# Altium project mecobo3.PrjPcb (part 2 of 2)
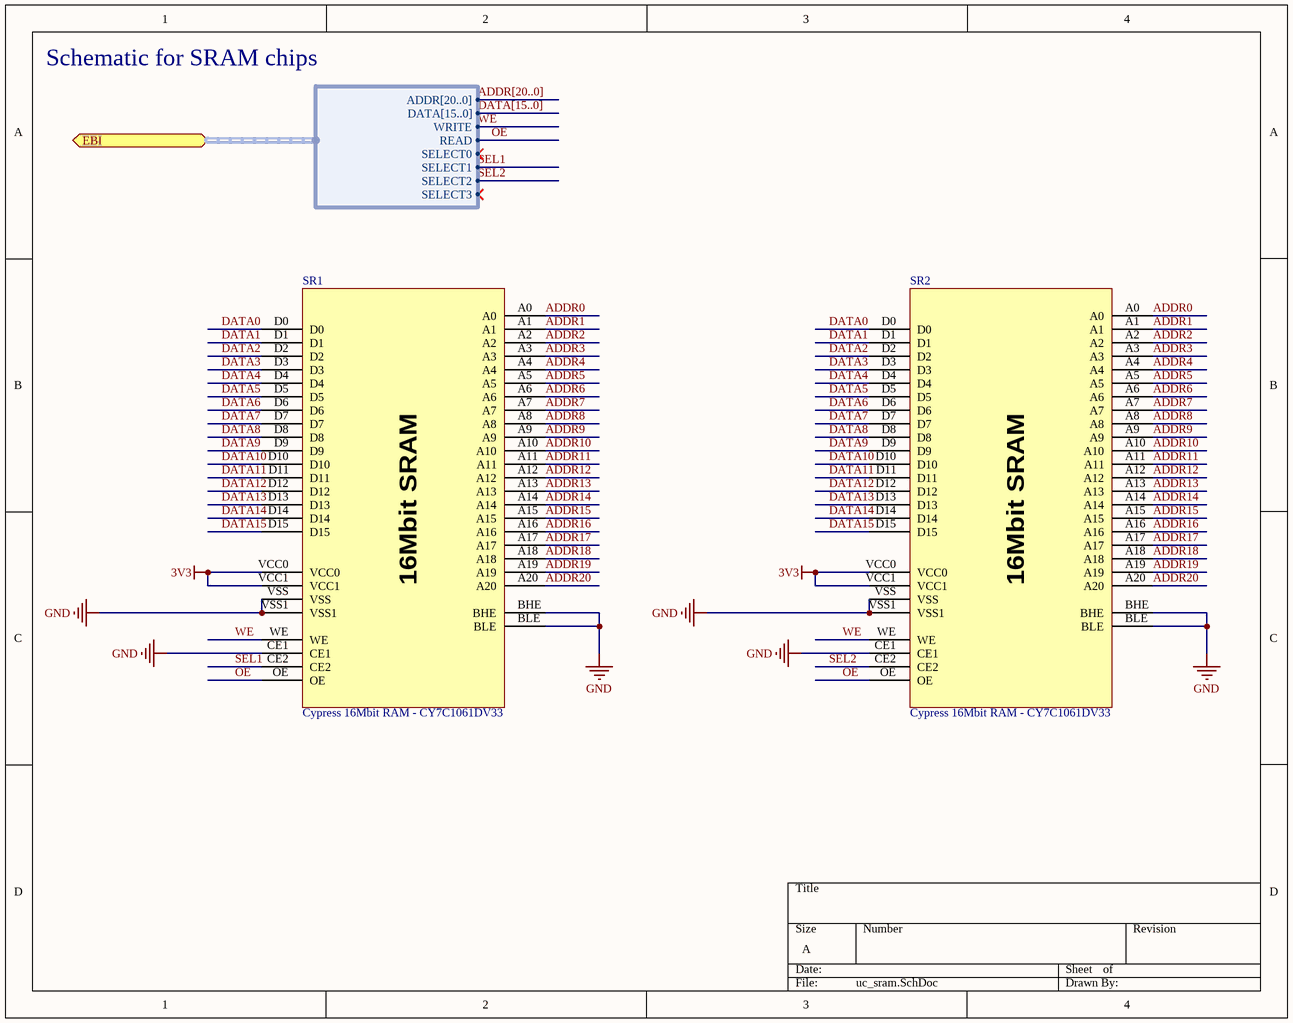
[diagram p14: uc_sram.SchDoc]

## Nets that join several sheets
0V9: xcs6slx25-2csg324i (FPGA.C1 FPGA.M5 FPGA.N3), psu (0V9.2), ddr2_memory (DDR.E2)
1V2: xcs6slx25-2csg324i (11 pins), psu (C2#1.1 POWT.1), MIC5248 (C4#3.2 MIC1.5), decoupling (10 pins)
1V8: xcs6slx25-2csg324i (30 pins), psu (C3#1.1 POWT.2), U_psu/MAX8860EUA18 (C1#2.2 PSU1.1 PSU1.4 R1#2.2), decoupling (10 pins), ddr2_memory (10 pins)
3V3: toplevel (OSC.1 OSC.4), efn32gg990 (11 pins), xcs6slx25-2csg324i (6 pins), psu (0V9.1 C1#1.1 POWT.3), U_psu/MAX8860EUA33 (C4#2.2 PSU2.1 PSU2.4 R2#2.2), MIC5248 (MIC1.3), decoupling (32 pins), headers (7 pins), uc_sram (SR1.VCC0 SR1.VCC1 SR2.VCC0 SR2.VCC1)
5V0: psu (C4#1.1 C6#1.1 D3.1 D5.1), U_psu/MAX8860EUA18 (C2#2.2 PSU1.2 PSU1.7), U_psu/MAX8860EUA33 (C5#1.2 PSU2.2 PSU2.7), MIC5248 (MIC1.1)
GND: toplevel (L1.1 OSC.2 R8.1), efn32gg990 (29 pins), xcs6slx25-2csg324i (44 pins), psu (9 pins), U_psu/MAX8860EUA18 (5 pins), U_psu/MAX8860EUA33 (5 pins), MIC5248 (C4#3.1 MIC1.2), decoupling (52 pins), ddr2_memory (11 pins), headers (7 pins), uc_sram (10 pins)
ADDR0: efn32gg990 (U.J4), xcs6slx25-2csg324i (FPGA.V5), uc_sram (SR1.A0 SR2.A0)
ADDR1: efn32gg990 (U.K3), xcs6slx25-2csg324i (FPGA.V4), uc_sram (SR1.A1 SR2.A1)
ADDR2: efn32gg990 (U.L3), xcs6slx25-2csg324i (FPGA.V3), uc_sram (SR1.A2 SR2.A2)
ADDR3: efn32gg990 (U.J7), xcs6slx25-2csg324i (FPGA.N6), uc_sram (SR1.A3 SR2.A3)
ADDR4: efn32gg990 (U.J8), xcs6slx25-2csg324i (FPGA.V6), uc_sram (SR1.A4 SR2.A4)
ADDR5: efn32gg990 (U.G10), xcs6slx25-2csg324i (FPGA.P6), uc_sram (SR1.A5 SR2.A5)
ADDR6: efn32gg990 (U.G11), xcs6slx25-2csg324i (FPGA.V7), uc_sram (SR1.A6 SR2.A6)
ADDR7: efn32gg990 (U.E9), xcs6slx25-2csg324i (FPGA.V11), uc_sram (SR1.A7 SR2.A7)
ADDR8: efn32gg990 (U.E10), xcs6slx25-2csg324i (FPGA.V10), uc_sram (SR1.A8 SR2.A8)
ADDR9: efn32gg990 (U.D11), xcs6slx25-2csg324i (FPGA.N9), uc_sram (SR1.A9 SR2.A9)
ADDR10: efn32gg990 (U.C10), xcs6slx25-2csg324i (FPGA.V9), uc_sram (SR1.A10 SR2.A10)
ADDR11: efn32gg990 (U.A9), xcs6slx25-2csg324i (FPGA.V8), uc_sram (SR1.A11 SR2.A11)
ADDR12: efn32gg990 (U.B9), xcs6slx25-2csg324i (FPGA.R7), uc_sram (SR1.A12 SR2.A12)
ADDR13: efn32gg990 (U.C9), xcs6slx25-2csg324i (FPGA.N8), uc_sram (SR1.A13 SR2.A13)
ADDR14: efn32gg990 (U.D9), xcs6slx25-2csg324i (FPGA.T9), uc_sram (SR1.A14 SR2.A14)
ADDR15: efn32gg990 (U.D10), xcs6slx25-2csg324i (FPGA.M10), uc_sram (SR1.A15 SR2.A15)
ADDR16: efn32gg990 (U.E4), xcs6slx25-2csg324i (FPGA.T4), uc_sram (SR1.A16 SR2.A16)
ADDR17: efn32gg990 (U.F1), xcs6slx25-2csg324i (FPGA.R3), uc_sram (SR1.A17 SR2.A17)
ADDR18: efn32gg990 (U.F2), xcs6slx25-2csg324i (FPGA.T3), uc_sram (SR1.A18 SR2.A18)
ADDR19: efn32gg990 (U.F3), xcs6slx25-2csg324i (FPGA.T6), uc_sram (SR1.A19 SR2.A19)
ADDR20: efn32gg990 (U.F4), xcs6slx25-2csg324i (FPGA.P7), uc_sram (SR1.A20 SR2.A20)
DATA0: efn32gg990 (U.B4), xcs6slx25-2csg324i (FPGA.V13), uc_sram (SR1.D0 SR2.D0)
DATA1: efn32gg990 (U.A4), xcs6slx25-2csg324i (FPGA.R11), uc_sram (SR1.D1 SR2.D1)
DATA2: efn32gg990 (U.C3), xcs6slx25-2csg324i (FPGA.U13), uc_sram (SR1.D2 SR2.D2)
DATA3: efn32gg990 (U.B3), xcs6slx25-2csg324i (FPGA.T10), uc_sram (SR1.D3 SR2.D3)
DATA4: efn32gg990 (U.A3), xcs6slx25-2csg324i (FPGA.U11), uc_sram (SR1.D4 SR2.D4)
DATA5: efn32gg990 (U.A2), xcs6slx25-2csg324i (FPGA.T8), uc_sram (SR1.D5 SR2.D5)
DATA6: efn32gg990 (U.B2), xcs6slx25-2csg324i (FPGA.R8), uc_sram (SR1.D6 SR2.D6)
DATA7: efn32gg990 (U.A1), xcs6slx25-2csg324i (FPGA.U8), uc_sram (SR1.D7 SR2.D7)
DATA8: efn32gg990 (U.B1), xcs6slx25-2csg324i (FPGA.T7), uc_sram (SR1.D8 SR2.D8)
DATA9: efn32gg990 (U.C2), xcs6slx25-2csg324i (FPGA.U7), uc_sram (SR1.D9 SR2.D9)
DATA10: efn32gg990 (U.C1), xcs6slx25-2csg324i (FPGA.N7), uc_sram (SR1.D10 SR2.D10)
DATA11: efn32gg990 (U.D2), xcs6slx25-2csg324i (FPGA.R5), uc_sram (SR1.D11 SR2.D11)
DATA12: efn32gg990 (U.D1), xcs6slx25-2csg324i (FPGA.U5), uc_sram (SR1.D12 SR2.D12)
DATA13: efn32gg990 (U.E3), xcs6slx25-2csg324i (FPGA.M8), uc_sram (SR1.D13 SR2.D13)
DATA14: efn32gg990 (U.E2), xcs6slx25-2csg324i (FPGA.N5), uc_sram (SR1.D14 SR2.D14)
DATA15: efn32gg990 (U.E1), xcs6slx25-2csg324i (FPGA.T5), uc_sram (SR1.D15 SR2.D15)
DDR2.DDR_BA0: xcs6slx25-2csg324i (FPGA.F2), ddr2_memory (DDR.G2)
DDR2.DDR_BA1: xcs6slx25-2csg324i (FPGA.F1), ddr2_memory (DDR.G3)
DDR2.DDR_BA2: xcs6slx25-2csg324i (FPGA.E1), ddr2_memory (DDR.G1)
DDR2.DDR_CASN: xcs6slx25-2csg324i (FPGA.K5), ddr2_memory (DDR.G7)
DDR2.DDR_CLK_N: xcs6slx25-2csg324i (FPGA.G1), ddr2_memory (DDR.F8)
DDR2.DDR_CLK_P: xcs6slx25-2csg324i (FPGA.G3), ddr2_memory (DDR.E8)
DDR2.DDR_CLKE: xcs6slx25-2csg324i (FPGA.H7), ddr2_memory (DDR.F2)
DDR2.DDR_DQS_N: xcs6slx25-2csg324i (FPGA.L3), ddr2_memory (DDR.A8)
DDR2.DDR_DQS_P: xcs6slx25-2csg324i (FPGA.L4), ddr2_memory (DDR.B7)
DDR2.DDR_LDM: xcs6slx25-2csg324i (FPGA.K3), ddr2_memory (DDR.B3)
DDR2.DDR_ODT: xcs6slx25-2csg324i (FPGA.K6), ddr2_memory (DDR.F9)
DDR2.DDR_RASN: xcs6slx25-2csg324i (FPGA.L5), ddr2_memory (DDR.F7)
DDR2.DDR_WE: xcs6slx25-2csg324i (FPGA.E3), ddr2_memory (DDR.F3)
DDR_A0: xcs6slx25-2csg324i (FPGA.J7), ddr2_memory (DDR.H8)
DDR_A1: xcs6slx25-2csg324i (FPGA.J6), ddr2_memory (DDR.H3)
DDR_A2: xcs6slx25-2csg324i (FPGA.H5), ddr2_memory (DDR.H7)
DDR_A3: xcs6slx25-2csg324i (FPGA.L7), ddr2_memory (DDR.J2)
DDR_A4: xcs6slx25-2csg324i (FPGA.F3), ddr2_memory (DDR.J3)
DDR_A5: xcs6slx25-2csg324i (FPGA.H4), ddr2_memory (DDR.J7)
DDR_A6: xcs6slx25-2csg324i (FPGA.H3), ddr2_memory (DDR.J8)
DDR_A7: xcs6slx25-2csg324i (FPGA.H6), ddr2_memory (DDR.K2)
DDR_A8: xcs6slx25-2csg324i (FPGA.D2), ddr2_memory (DDR.K8)
DDR_A9: xcs6slx25-2csg324i (FPGA.D1), ddr2_memory (DDR.K3)
DDR_A10: xcs6slx25-2csg324i (FPGA.F4), ddr2_memory (DDR.H2)
DDR_A11: xcs6slx25-2csg324i (FPGA.D3), ddr2_memory (DDR.K7)
DDR_A12: xcs6slx25-2csg324i (FPGA.G6), ddr2_memory (DDR.L2)
DDR_A13: xcs6slx25-2csg324i (FPGA.F6), ddr2_memory (DDR.L8)
DDR_DQ0: xcs6slx25-2csg324i (FPGA.L2), ddr2_memory (DDR.C8)
DDR_DQ1: xcs6slx25-2csg324i (FPGA.J3), ddr2_memory (DDR.C2)
DDR_DQ2: xcs6slx25-2csg324i (FPGA.K2), ddr2_memory (DDR.D7)
DDR_DQ3: xcs6slx25-2csg324i (FPGA.J1), ddr2_memory (DDR.D3)
DDR_DQ4: xcs6slx25-2csg324i (FPGA.H1), ddr2_memory (DDR.D1)
DDR_DQ5: xcs6slx25-2csg324i (FPGA.K1), ddr2_memory (DDR.D9)
DDR_DQ6: xcs6slx25-2csg324i (FPGA.H2), ddr2_memory (DDR.B1)
DDR_DQ7: xcs6slx25-2csg324i (FPGA.L1), ddr2_memory (DDR.B9)
DDR_RZQ: toplevel (R8.2), xcs6slx25-2csg324i (FPGA.N4)
EBI.READ: efn32gg990 (U.C6), xcs6slx25-2csg324i (FPGA.V16), uc_sram (SR1.OE SR2.OE)
EBI.SELECT0: efn32gg990 (U.D6), xcs6slx25-2csg324i (FPGA.V14)
EBI.SELECT1: efn32gg990 (U.A5), uc_sram (SR1.CE2)
EBI.SELECT2: efn32gg990 (U.B5), uc_sram (SR2.CE2)
EBI.WRITE: efn32gg990 (U.B6), xcs6slx25-2csg324i (FPGA.V15), uc_sram (SR1.WE SR2.WE)
FPGA_CCLK: efn32gg990 (U.H5), xcs6slx25-2csg324i (FPGA.R15 R4.2 R5.2), headers (HEast.32)
FPGA_DIN: efn32gg990 (U.H4), xcs6slx25-2csg324i (FPGA.R13), headers (HEast.34)
FPGA_DONE: efn32gg990 (U.C5), xcs6slx25-2csg324i (FPGA.V17 R1#1.2), headers (HEast.31)
FPGA_INIT_B: efn32gg990 (U.J3), xcs6slx25-2csg324i (FPGA.U3 R3.2), headers (HEast.33)
FPGA_PROG_B: efn32gg990 (U.J2), xcs6slx25-2csg324i (FPGA.V2 R2#1.2), headers (HEast.35)
FPGA_READY: efn32gg990 (U.G1), xcs6slx25-2csg324i (FPGA.T12)
HE2: xcs6slx25-2csg324i (FPGA.P8), headers (HEast.12)
HE3: xcs6slx25-2csg324i (FPGA.U10), headers (HEast.14)
HE4: xcs6slx25-2csg324i (FPGA.P11), headers (HEast.10)
HE5: xcs6slx25-2csg324i (FPGA.N10), headers (HEast.8)
HE6: xcs6slx25-2csg324i (FPGA.V12), headers (HEast.11)
HE7: xcs6slx25-2csg324i (FPGA.T11), headers (HEast.13)
HE8: xcs6slx25-2csg324i (FPGA.N11), headers (HEast.6)
HE9: xcs6slx25-2csg324i (FPGA.M11), headers (HEast.2)
HE10: xcs6slx25-2csg324i (FPGA.P12), headers (HEast.4)
HE11: xcs6slx25-2csg324i (FPGA.T14), headers (HEast.5)
HE12: xcs6slx25-2csg324i (FPGA.U15), headers (HEast.3)
HE13: xcs6slx25-2csg324i (FPGA.T13), headers (HEast.7)
HE14: xcs6slx25-2csg324i (FPGA.U16), headers (HEast.1)
HE15: xcs6slx25-2csg324i (FPGA.P3), headers (HEast.15)
HE16: xcs6slx25-2csg324i (FPGA.L6), headers (HEast.9)
HE17: xcs6slx25-2csg324i (FPGA.U2), headers (HEast.18)
HE18: xcs6slx25-2csg324i (FPGA.U1), headers (HEast.19)
HE19: xcs6slx25-2csg324i (FPGA.T2), headers (HEast.17)
HE20: xcs6slx25-2csg324i (FPGA.T1), headers (HEast.20)
HE21: xcs6slx25-2csg324i (FPGA.P2), headers (HEast.16)
HE22: xcs6slx25-2csg324i (FPGA.P1), headers (HEast.21)
HN0: xcs6slx25-2csg324i (FPGA.F15), headers (HNorth.13)
HN1: xcs6slx25-2csg324i (FPGA.F16), headers (HNorth.2)
HN2: xcs6slx25-2csg324i (FPGA.C17), headers (HNorth.1)
HN3: xcs6slx25-2csg324i (FPGA.C18), headers (HNorth.3)
HN4: xcs6slx25-2csg324i (FPGA.F14), headers (HNorth.17)
HN5: xcs6slx25-2csg324i (FPGA.G14), headers (HNorth.6)
HN6: xcs6slx25-2csg324i (FPGA.D17), headers (HNorth.5)
HN7: xcs6slx25-2csg324i (FPGA.D18), headers (HNorth.7)
HN8: xcs6slx25-2csg324i (FPGA.H12), headers (HNorth.30)
HN9: xcs6slx25-2csg324i (FPGA.G13), headers (HNorth.21)
HN10: xcs6slx25-2csg324i (FPGA.E16), headers (HNorth.9)
HN11: xcs6slx25-2csg324i (FPGA.E18), headers (HNorth.11)
HN12: xcs6slx25-2csg324i (FPGA.K12), headers (HNorth.24)
HN13: xcs6slx25-2csg324i (FPGA.K13), headers (HNorth.31)
HN14: xcs6slx25-2csg324i (FPGA.F17), headers (HNorth.4)
HN15: xcs6slx25-2csg324i (FPGA.F18), headers (HNorth.15)
HN16: xcs6slx25-2csg324i (FPGA.H13), headers (HNorth.25)
HN17: xcs6slx25-2csg324i (FPGA.H14), headers (HNorth.20)
HN18: xcs6slx25-2csg324i (FPGA.H15), headers (HNorth.16)
HN19: xcs6slx25-2csg324i (FPGA.H16), headers (HNorth.10)
HN20: xcs6slx25-2csg324i (FPGA.G16), headers (HNorth.8)
HN21: xcs6slx25-2csg324i (FPGA.G18), headers (HNorth.19)
HN22: xcs6slx25-2csg324i (FPGA.J13), headers (HNorth.29)
HN23: xcs6slx25-2csg324i (FPGA.K14), headers (HNorth.22)
HN24: xcs6slx25-2csg324i (FPGA.L12), headers (HNorth.18)
HN25: xcs6slx25-2csg324i (FPGA.L13), headers (HNorth.32)
HN26: xcs6slx25-2csg324i (FPGA.K15), headers (HNorth.38)
HN27: xcs6slx25-2csg324i (FPGA.K16), headers (HNorth.28)
HN28: xcs6slx25-2csg324i (FPGA.L15), headers (HNorth.36)
HN29: xcs6slx25-2csg324i (FPGA.L16), headers (HNorth.42)
HN30: xcs6slx25-2csg324i (FPGA.H17), headers (HNorth.12)
HN31: xcs6slx25-2csg324i (FPGA.H18), headers (HNorth.23)
HN32: xcs6slx25-2csg324i (FPGA.J16), headers (HNorth.14)
HN33: xcs6slx25-2csg324i (FPGA.J18), headers (HNorth.27)
HN34: xcs6slx25-2csg324i (FPGA.K17), headers (HNorth.26)
HN35: xcs6slx25-2csg324i (FPGA.K18), headers (HNorth.33)
HN36: xcs6slx25-2csg324i (FPGA.L17), headers (HNorth.40)
HN37: xcs6slx25-2csg324i (FPGA.L18), headers (HNorth.34)
HN38: xcs6slx25-2csg324i (FPGA.M16), headers (HNorth.44)
HN39: xcs6slx25-2csg324i (FPGA.M18), headers (HNorth.37)
HN40: xcs6slx25-2csg324i (FPGA.N17), headers (HNorth.43)
HN41: xcs6slx25-2csg324i (FPGA.N18), headers (HNorth.41)
HN42: xcs6slx25-2csg324i (FPGA.P17), headers (HNorth.50)
HN43: xcs6slx25-2csg324i (FPGA.P18), headers (HNorth.45)
HN44: xcs6slx25-2csg324i (FPGA.N15), headers (HNorth.39)
HN45: xcs6slx25-2csg324i (FPGA.N16), headers (HNorth.47)
HN46: xcs6slx25-2csg324i (FPGA.T17), headers (HNorth.55)
HN47: xcs6slx25-2csg324i (FPGA.T18), headers (HNorth.49)
HN48: xcs6slx25-2csg324i (FPGA.U17), headers (HNorth.57)
HN49: xcs6slx25-2csg324i (FPGA.U18), headers (HNorth.51)
HN50: xcs6slx25-2csg324i (FPGA.M14), headers (HNorth.48)
HN51: xcs6slx25-2csg324i (FPGA.N14), headers (HNorth.54)
HN52: xcs6slx25-2csg324i (FPGA.L14), headers (HNorth.46)
HN53: xcs6slx25-2csg324i (FPGA.M13), headers (HNorth.35)
HN54: xcs6slx25-2csg324i (FPGA.P15), headers (HNorth.53)
HN55: xcs6slx25-2csg324i (FPGA.P16), headers (HNorth.52)
HW0: xcs6slx25-2csg324i (FPGA.A16), headers (HWest.2)
HW1: xcs6slx25-2csg324i (FPGA.B16), headers (HWest.10)
HW2: xcs6slx25-2csg324i (FPGA.C14), headers (HWest.3)
HW3: xcs6slx25-2csg324i (FPGA.D14), headers (HWest.1)
HW4: xcs6slx25-2csg324i (FPGA.A15), headers (HWest.4)
HW5: xcs6slx25-2csg324i (FPGA.C15), headers (HWest.14)
HW6: xcs6slx25-2csg324i (FPGA.E13), headers (HWest.7)
HW7: xcs6slx25-2csg324i (FPGA.F13), headers (HWest.5)
HW8: xcs6slx25-2csg324i (FPGA.A14), headers (HWest.6)
HW9: xcs6slx25-2csg324i (FPGA.B14), headers (HWest.18)
HW10: xcs6slx25-2csg324i (FPGA.E12), headers (HWest.12)
HW11: xcs6slx25-2csg324i (FPGA.F12), headers (HWest.9)
HW12: xcs6slx25-2csg324i (FPGA.A13), headers (HWest.8)
HW13: xcs6slx25-2csg324i (FPGA.C13), headers (HWest.22)
HW14: xcs6slx25-2csg324i (FPGA.C12), headers (HWest.20)
HW15: xcs6slx25-2csg324i (FPGA.D12), headers (HWest.11)
HW16: xcs6slx25-2csg324i (FPGA.E11), headers (HWest.19)
HW17: xcs6slx25-2csg324i (FPGA.F11), headers (HWest.17)
HW18: xcs6slx25-2csg324i (FPGA.A12), headers (HWest.16)
HW19: xcs6slx25-2csg324i (FPGA.B12), headers (HWest.26)
HW20: xcs6slx25-2csg324i (FPGA.F10), headers (HWest.23)
HW21: xcs6slx25-2csg324i (FPGA.G11), headers (HWest.21)
HW22: xcs6slx25-2csg324i (FPGA.A11), headers (HWest.24)
HW23: xcs6slx25-2csg324i (FPGA.B11), headers (HWest.30)
HW24: xcs6slx25-2csg324i (FPGA.F9), headers (HWest.27)
HW25: xcs6slx25-2csg324i (FPGA.G9), headers (HWest.33)
HW26: xcs6slx25-2csg324i (FPGA.A10), headers (HWest.28)
HW27: xcs6slx25-2csg324i (FPGA.C10), headers (HWest.34)
HW28: xcs6slx25-2csg324i (FPGA.C11), headers (HWest.15)
HW29: xcs6slx25-2csg324i (FPGA.D11), headers (HWest.13)
HW30: xcs6slx25-2csg324i (FPGA.A9), headers (HWest.32)
HW31: xcs6slx25-2csg324i (FPGA.B9), headers (HWest.38)
HW32: xcs6slx25-2csg324i (FPGA.C9), headers (HWest.31)
HW33: xcs6slx25-2csg324i (FPGA.D9), headers (HWest.25)
HW34: xcs6slx25-2csg324i (FPGA.A8), headers (HWest.36)
HW35: xcs6slx25-2csg324i (FPGA.B8), headers (HWest.42)
HW36: xcs6slx25-2csg324i (FPGA.C8), headers (HWest.37)
HW37: xcs6slx25-2csg324i (FPGA.D8), headers (HWest.35)
HW38: xcs6slx25-2csg324i (FPGA.A7), headers (HWest.40)
HW39: xcs6slx25-2csg324i (FPGA.C7), headers (HWest.46)
HW40: xcs6slx25-2csg324i (FPGA.A6), headers (HWest.44)
HW41: xcs6slx25-2csg324i (FPGA.B6), headers (HWest.50)
HW42: xcs6slx25-2csg324i (FPGA.A5), headers (HWest.48)
HW43: xcs6slx25-2csg324i (FPGA.C5), headers (HWest.54)
HW44: xcs6slx25-2csg324i (FPGA.A4), headers (HWest.52)
HW45: xcs6slx25-2csg324i (FPGA.B4), headers (HWest.58)
HW46: xcs6slx25-2csg324i (FPGA.A3), headers (HWest.56)
HW47: xcs6slx25-2csg324i (FPGA.B3), headers (HWest.45)
HW48: xcs6slx25-2csg324i (FPGA.C6), headers (HWest.39)
HW49: xcs6slx25-2csg324i (FPGA.D6), headers (HWest.41)
HW50: xcs6slx25-2csg324i (FPGA.A2), headers (HWest.60)
HW51: xcs6slx25-2csg324i (FPGA.B2), headers (HWest.47)
HW52: xcs6slx25-2csg324i (FPGA.C4), headers (HWest.43)
MISC1: efn32gg990 (U.L5), headers (HEast.52)
MISC2: efn32gg990 (U.L1), headers (HEast.56)
MISC3: efn32gg990 (U.K1), headers (HEast.55)
MISC4: efn32gg990 (U.K5), headers (HEast.51)
MISC8: efn32gg990 (U.H3), headers (HEast.37)
MISC10: efn32gg990 (U.H8), headers (HEast.54)
MISC11: efn32gg990 (U.H11), headers (HEast.42)
MISC12: efn32gg990 (U.H10), headers (HEast.41)
MISC13: efn32gg990 (U.H9), headers (HEast.40)
MISC14: efn32gg990 (U.J11), headers (HEast.44)
MISC15: efn32gg990 (U.J10), headers (HEast.45)
MISC16: efn32gg990 (U.L2), headers (HEast.53)
MISC25: toplevel (USB.1), efn32gg990 (L0.2), headers (HEast.57)
MISC26: toplevel (USB.2), efn32gg990 (R10.2), headers (HEast.59)
MISC27: toplevel (USB.3), efn32gg990 (R11.2), headers (HEast.58)
NetFPGA_R10: toplevel (OSC.3), xcs6slx25-2csg324i (FPGA.R10)